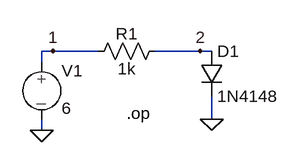
[diagram p0: schematic diode_arbeitspunkt.asc]
diode_arbeitspunkt.asc, the LTspice schematic file:
Version 4
SHEET 1 880 680
WIRE -48 48 -64 48
WIRE 16 48 -48 48
WIRE 160 48 96 48
WIRE 176 48 160 48
WIRE -64 64 -64 48
WIRE 176 144 176 112
WIRE -64 160 -64 144
FLAG 176 144 0
FLAG -64 160 0
FLAG 160 48 2
FLAG -48 48 1
SYMBOL diode 160 48 R0
SYMATTR InstName D1
SYMATTR Value 1N4148
SYMBOL res 0 64 R270
WINDOW 0 25 56 VTop 2
WINDOW 3 7 56 VBottom 2
SYMATTR InstName R1
SYMATTR Value 1k
SYMBOL source-V -64 48 R0
SYMATTR InstName V1
SYMATTR Value 6
TEXT 56 136 Left 2 !.op

The netlist it stands for:
* diode_arbeitspunkt.asc
D1 2 0 1N4148
R1 1 2 1k
V1 1 0 6
.model D D
.lib standard.dio
.op
.backanno
.end